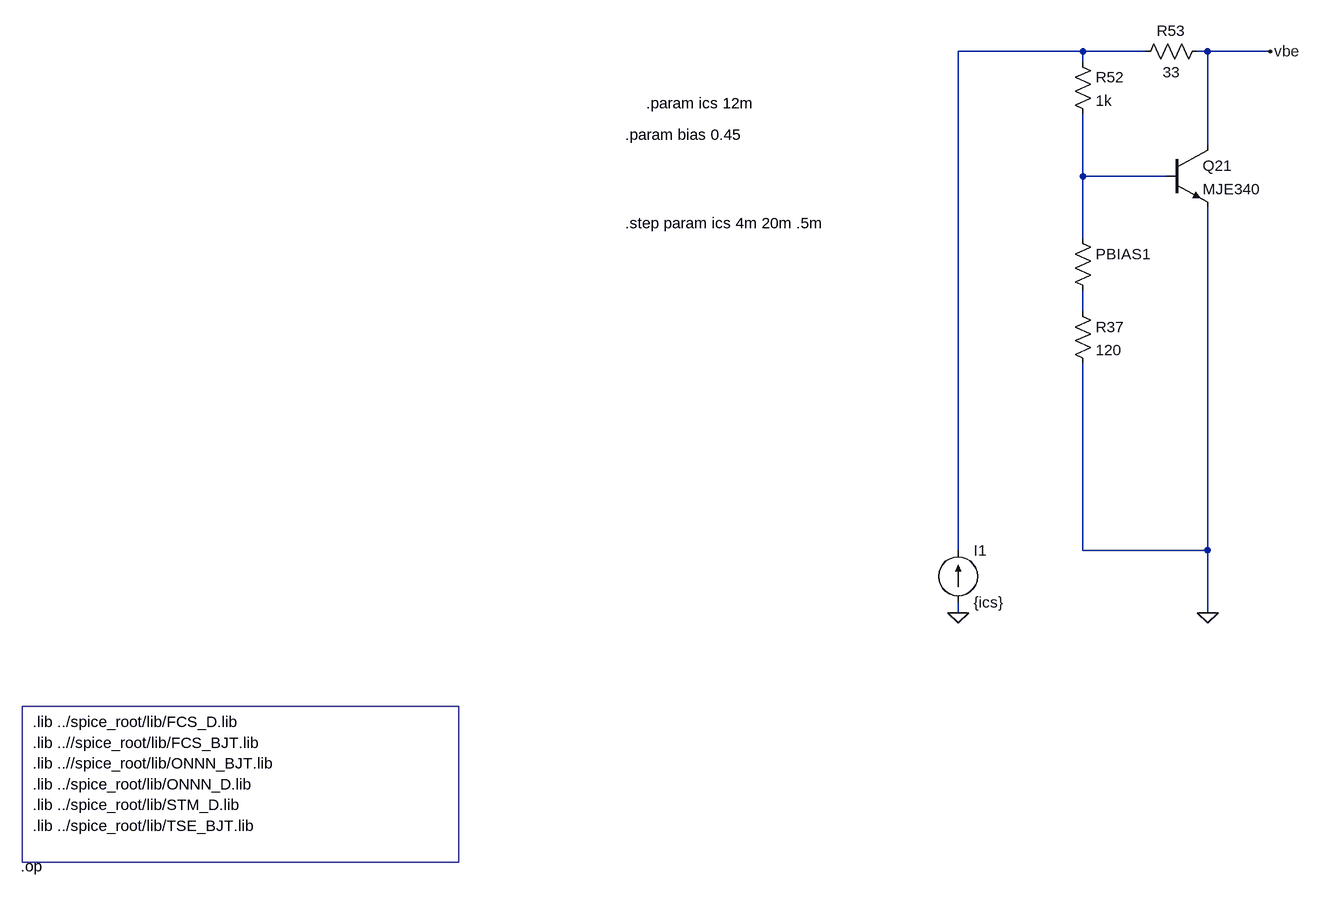
[diagram p0: schematic pab3bbb-compact-vbe.asc]
pab3bbb-compact-vbe.asc, the LTspice schematic file:
Version 4
SHEET 1 6124 2336
WIRE 384 -608 192 -608
WIRE 480 -608 384 -608
WIRE 576 -608 560 -608
WIRE 672 -608 576 -608
WIRE 384 -592 384 -608
WIRE 576 -464 576 -608
WIRE 384 -416 384 -512
WIRE 512 -416 384 -416
WIRE 384 -320 384 -416
WIRE 384 -208 384 -240
WIRE 192 160 192 -608
WIRE 384 160 384 -128
WIRE 576 160 576 -368
WIRE 576 160 384 160
WIRE 192 256 192 240
WIRE 576 256 576 160
FLAG 576 256 0
FLAG 672 -608 vbe
FLAG 192 256 0
SYMBOL res 368 -336 R0
WINDOW 3 36 76 Invisible 2
SYMATTR Value {1+(500*BIAS)}
SYMATTR InstName PBIAS1
SYMBOL res 368 -608 R0
SYMATTR InstName R52
SYMATTR Value 1k
SYMBOL res 576 -624 R90
WINDOW 0 0 56 VBottom 2
WINDOW 3 32 56 VTop 2
SYMATTR InstName R53
SYMATTR Value 33
SYMBOL npn 512 -464 R0
SYMATTR InstName Q21
SYMATTR Value MJE340
SYMBOL res 368 -224 R0
SYMATTR InstName R37
SYMATTR Value 120
SYMBOL current 192 240 M180
WINDOW 0 24 80 Left 2
WINDOW 3 24 0 Left 2
WINDOW 123 0 0 Left 0
WINDOW 39 0 0 Left 0
SYMATTR InstName I1
SYMATTR Value {ics}
TEXT -1232 488 Left 2 !.lib ..//spice_root/lib/ONNN_BJT.lib
TEXT -1232 552 Left 2 !.lib ../spice_root/lib/STM_D.lib
TEXT -1232 456 Left 2 !.lib ..//spice_root/lib/FCS_BJT.lib
TEXT -1232 424 Left 2 !.lib ../spice_root/lib/FCS_D.lib
TEXT -1232 520 Left 2 !.lib ../spice_root/lib/ONNN_D.lib
TEXT -1232 584 Left 2 !.lib ../spice_root/lib/TSE_BJT.lib
TEXT -288 -528 Left 2 !.param ics 12m
TEXT -1250 646 Left 2 !.op
TEXT -320 -480 Left 2 !.param bias 0.45
TEXT -320 -344 Left 2 !.step param ics 4m 20m .5m
RECTANGLE Normal -576 640 -1248 400

The netlist it stands for:
* pab3bbb-compact-vbe.asc
R§PBIAS1 N002 N003 {1+(500*BIAS)}
R52 N001 N002 1k
R53 vbe N001 33
Q21 vbe N002 0 0 MJE340
R37 N003 0 120
I1 0 N001 {ics}
.model NPN NPN
.model PNP PNP
.lib standard.bjt
.lib ..//spice_root/lib/ONNN_BJT.lib
.lib ../spice_root/lib/STM_D.lib
.lib ..//spice_root/lib/FCS_BJT.lib
.lib ../spice_root/lib/FCS_D.lib
.lib ../spice_root/lib/ONNN_D.lib
.lib ../spice_root/lib/TSE_BJT.lib
.param ics 12m
.op
.param bias 0.45
.step param ics 4m 20m .5m
.backanno
.end